# EasyEDA Pro project ZIAD_DBW_PROJECT_EDIT_9_MAY_2025.epro, board DBW_v4.1_2
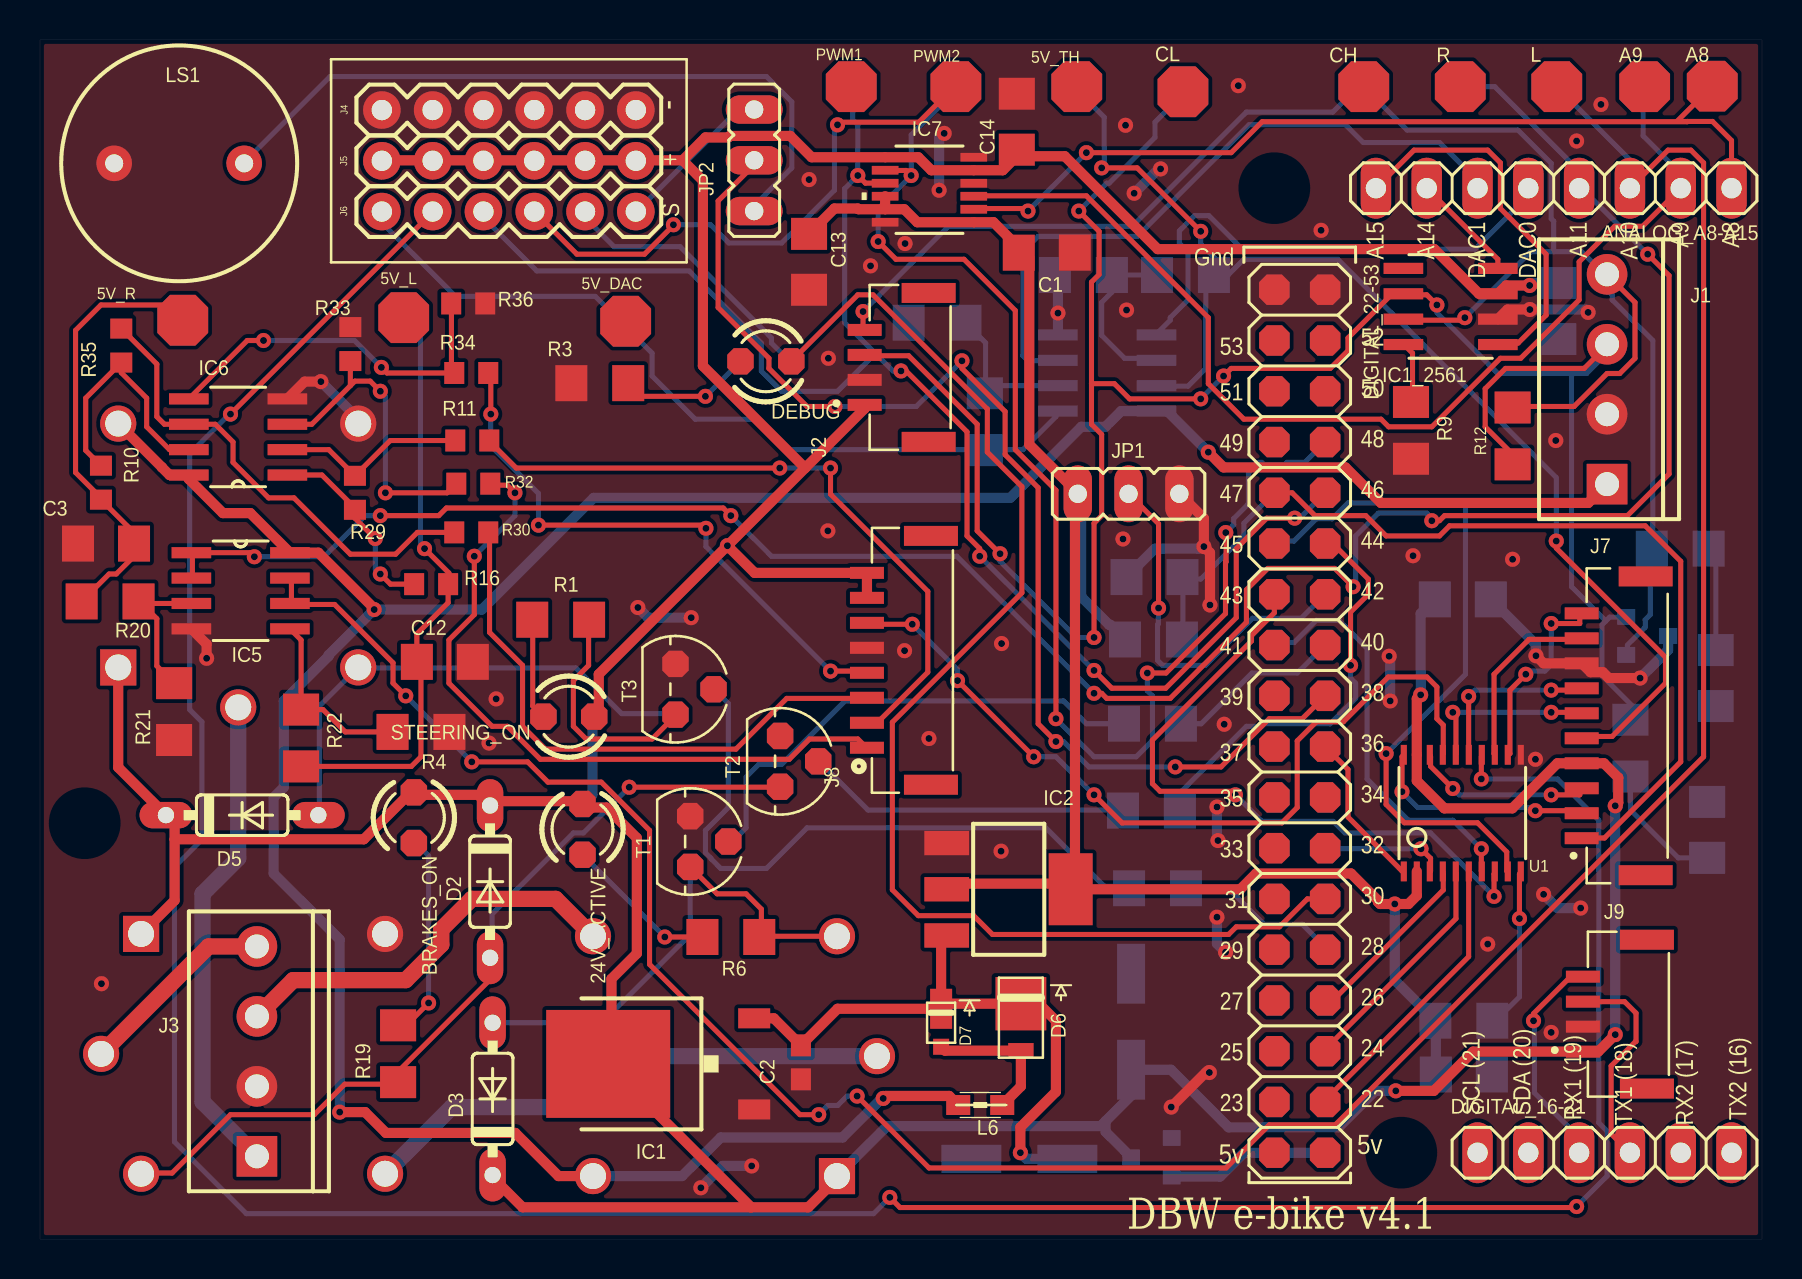
[diagram p7: board, top side]
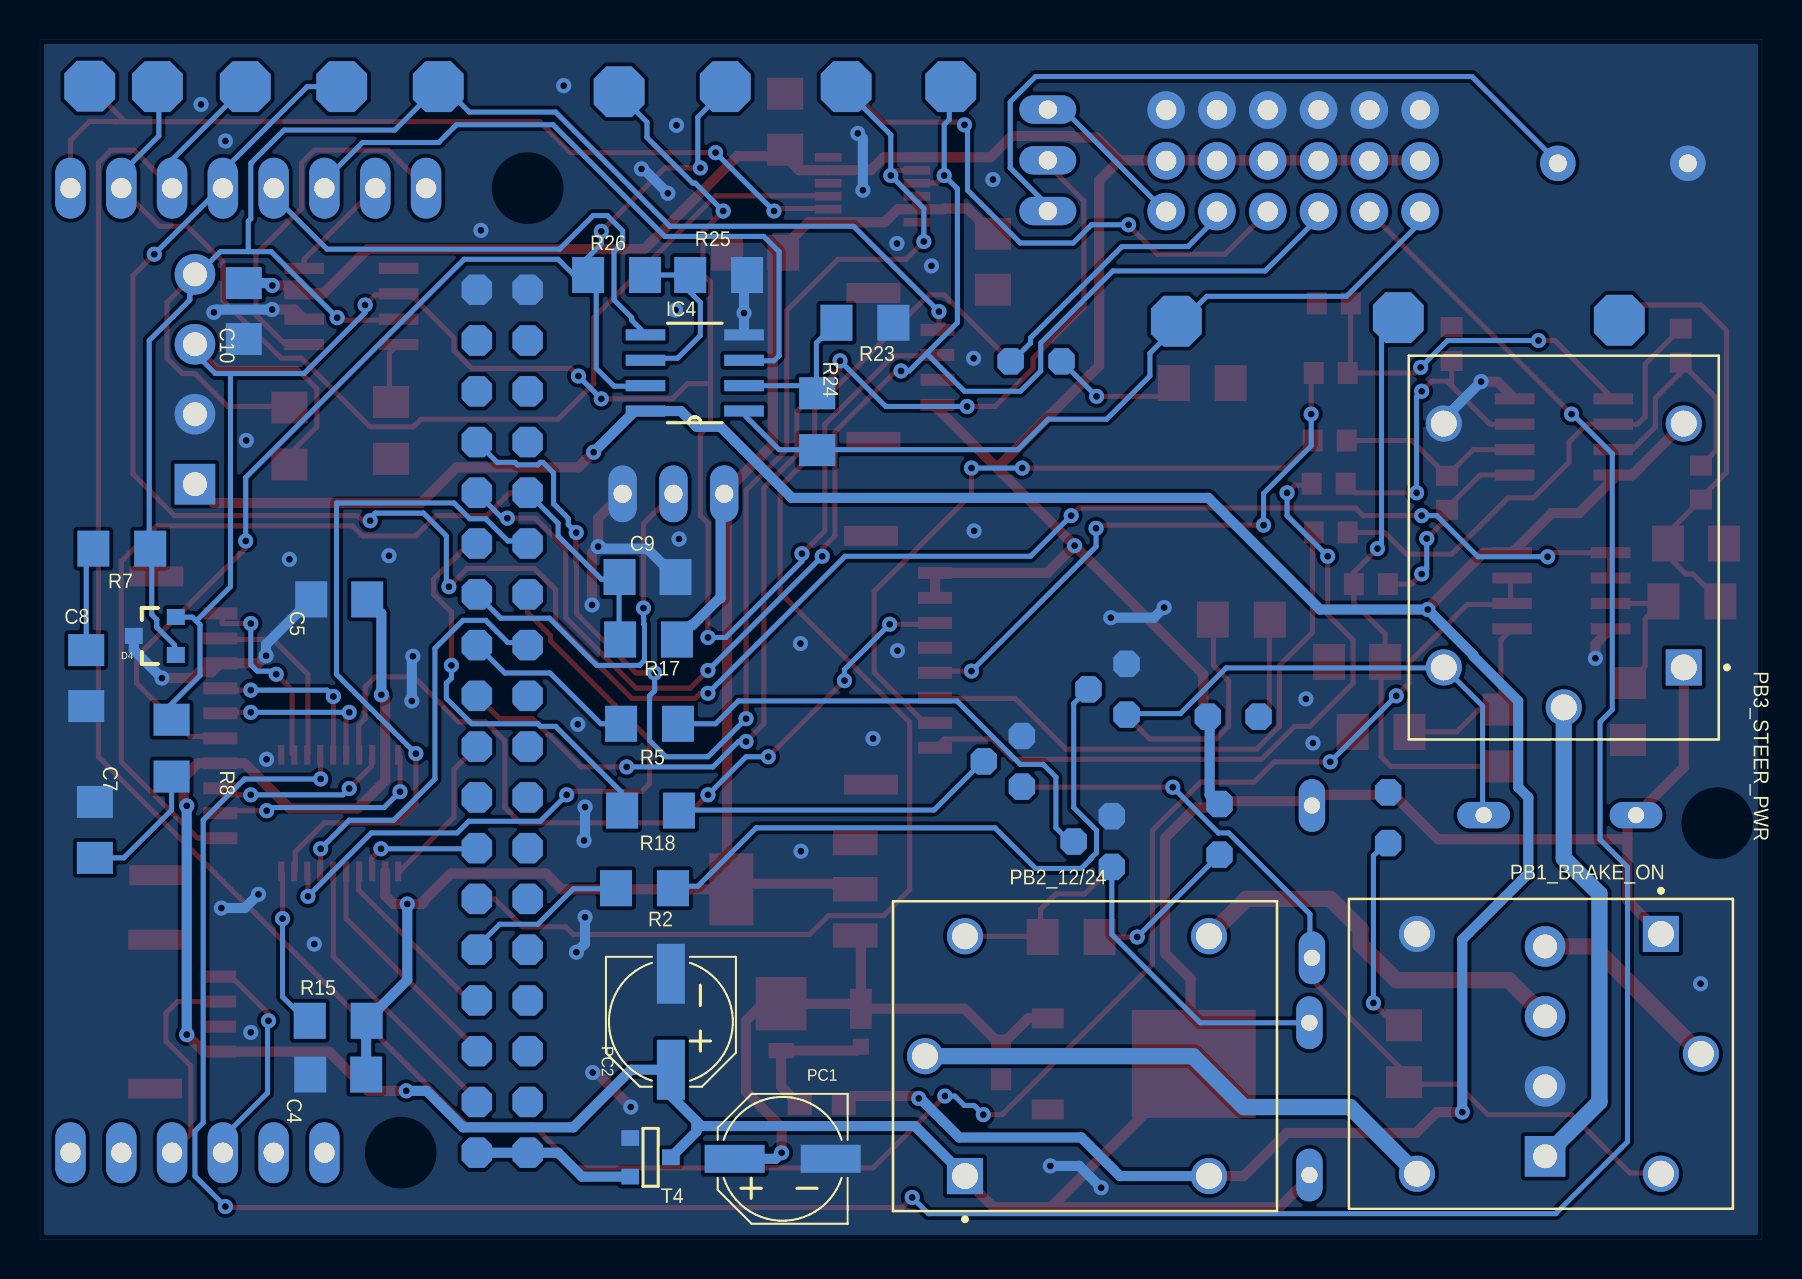
[diagram p8: board, bottom side, seen from below]

Outline 86.11 x 60 mm; copper layers: Top Layer, Bottom Layer. Coordinates in mm from the lower left corner of the outline.
Outline path: 0,60 0,0 86.11,0 86.11,60 0,60
Stack: Top Layer 0.035mm / Dielectric1 1.51mm FR4 er 4.5 / Bottom Layer 0.035mm

## Design rules (mm)
spacing safeClearance (default): track to track 0.254, other pairs 0.254 to 1.016
spacing Power: track to track 0.254, other pairs 0.254 to 1.016
spacing High Current: track to track 0.762, other pairs 0.762 to 1.016
spacing SPI_Signals: track to track 0.254, other pairs 0.254 to 1.016
spacing Oscillator: track to track 0.508, other pairs 0.508 to 1.016
track width trackWidth (default): min 0.254, default 0.254, max 2.54
track width Power: min 0.508, default 0.508, max 2.54
track width High Current: min 0.508, default 0.508, max 2.54
track width SPI_Signals: min 0.254, default 0.254, max 2.54
track width Oscillator: min 0.254, default 0.254, max 2.54
differential pair differentialPair (default): width min 0.127, default 0.254, max 2.54; gap min 0.152, default 0.152
via viaSize: diameter min 0.35, default 0.35, max 2.6; hole min 0.35, default 0.35, max 2
via default: diameter min 0.305, default 0.305, max 2.6; hole min 0.305, default 0.305, max 2
via Power: diameter min 0.305, default 0.305, max 2.6; hole min 0.305, default 0.305, max 2
via High Current: diameter min 0.305, default 0.305, max 2.6; hole min 0.305, default 0.305, max 2
via SPI_Signals (default): diameter min 0, default 0, max 2.6; hole min 0, default 0, max 2
via Oscillator: diameter min 0, default 0, max 2.6; hole min 0, default 0, max 2
net GND uses CopperRegion1, Power
net ARD+5V uses Power
net 12V_PROTECTION uses Power
net +3V3 uses Power
net +12V uses Power
net +5V uses Power
net +24V uses High Current
net 12V_OUT uses High Current
net SOLENOID_POWER uses High Current
pour ie1 uses CopperRegion
pour ie2 uses CopperRegion1

## Placement (name value [footprint] x y rotation side)
5V_DAC  PTR1PAD1-17  [P1-17]  29.29 45.92 0 top
5V_L  PTR1PAD1-17  [P1-17]  18.19 46.1 0 top
5V_R  PTR1PAD1-17  [P1-17]  7.14 45.97 0 top
5V_TH  PTR1PAD1-17  [P1-17]  51.84 57.66 0 top
24V_ACTIVE  LED3  [LED3MM]  27.13 20.5 270 top
A8  PTR1PAD1-17  [P1-17]  83.62 57.68 0 top
A9  PTR1PAD1-17  [P1-17]  80.24 57.66 0 top
ANALOG_A8-A15  ANALOG_A8-A15  [1X08]  75.69 52.58 180 top
BRAKES_ON  LED2  [LED3MM]  18.69 21.08 270 top
C1  0.1uF  [C1206]  50.34 49.35 0 top
C2  100n  [C0603]  38.05 8.84 90 top
C3  1uF  [C1206]  3.3 34.8 180 top
C4  0.1uF  [C1206]  71.2 8.23 0 bottom
C5  0.1uF  [C1206]  71.15 32 0 bottom
C7  560pF  [C1206]  83.36 20.47 90 bottom
C8  560pF  [C1206]  83.79 28.07 270 bottom
C9  1uF  [C1206]  55.73 33.12 180 bottom
C10  0.1uF  [C1206]  75.92 46.43 270 bottom
C12  1uF  [C1206]  20.24 28.88 0 top
C13  0.1uF  [C1206]  38.46 48.89 270 top
C14  0.1uF  [C1206]  48.84 55.91 90 top
CH  PTR1PAD1-17  [P1-17]  66.19 57.66 180 top
CL  PTR1PAD1-17  [P1-17]  57.15 57.4 0 top
D2  1N4148DO35-7  [DO35-7]  22.5 17.88 270 top
D3  1N4148DO35-7  [DO35-7]  22.63 7.01 90 top
D4  PESD1CAN  [SPARKFUN-DISCRETESEMI_SOT23-3]  80.31 30.17 90 bottom
D5  1N4148DO35-7  [DO35-7]  10.11 21.21 0 top
D6  SS1P3L  [DO220AAL]  49.05 11.07 270 top
D7  MSS1P3L-M3/89A  [MICROSMP]  45.06 10.82 270 top
DEBUG  DS1  [LED3MM]  36.3 43.92 180 top
DIGITAL_16-21  DIGITAL_16-21  [1X06]  78.23 4.32 0 top
DIGITAL_22-53  Digital 22-53  [PINHEAD_2X18]  62.99 25.91 270 top
IC1  MC33269D-5.0  [DPACK]  30.91 8.76 90 top
IC1_2561  MCP2561-E/SN  [SOIC8-N_MC_MCH]  70.54 46.66 180 top
IC2  MC33269ST-3.3T3  [SOT223]  48.44 17.5 270 top
IC4  LM358D  [D8]  53.37 43.33 0 bottom
IC5  LM358D  [D8]  10.03 32.44 0 top
IC6  LM358D  [D8]  9.91 40.13 180 top
IC7  LTC2644CMS-L10PBF  [MSOP-12_MS_LIT]  44.48 52.5 180 top
J1  CAN_1  [SCREWTERMINAL-3.5MM-4]  78.36 37.77 90 top
J2  CAN_2  [JST_SM04B-GHS-TB(LF)(SN)-]  43.51 43.61 90 top
J3  Brake_Steer_Connector  [SCREWTERMINAL-3.5MM-4]  10.85 4.14 90 top
J4  Ground  [1X06#2]  17.09 56.49 0 top
J5  Power  [1X06#2]  17.09 53.95 0 top
J6  Signal  [1X06#2]  17.09 51.41 0 top
J7  MOTOR  [JST_SM10B-GHS-TB(LF)(SN)]  80.29 25.68 90 top
J8  STEERING  [JST_SM08B-GHS-TB(LF)(SN)]  41.35 28.96 90 top
J9  ROS_CONN  [JST_SM04B-GHS-TB(LF)(SN)-]  79.43 11.25 90 top
JP1  3 pin  [JP2]  54.43 37.29 0 top
JP2  3 pin  [JP2]  35.71 53.97 90 top
L  PTR1PAD1-17  [P1-17]  75.84 57.66 0 top
L6  MH2029-300Y  [0805]  47.02 6.71 180 top
LS1  BUZZER-PTH  [BUZZER-12MM]  6.96 53.82 0 top
PB1_BRAKE_ON  ORWH-SH-105D1F,000  [TE_ORWH-SH-105D1F,000]  5.05 15.27 0 bottom
PB2_12/24  ORWH-SH-105D1F,000  [TE_ORWH-SH-105D1F,000]  39.85 3.15 180 bottom
PB3_STEER_PWR  ORWH-SH-105D1F,000  [TE_ORWH-SH-105D1F,000]  3.91 28.6 90 bottom
PC1  47u  [PANASONIC_D]  48.97 4.01 0 bottom
PC2  47u  [PANASONIC_D]  54.56 10.87 270 bottom
PWM1  PTR1PAD1-17  [P1-17]  40.56 57.66 0 top
PWM2  PTR1PAD1-17  [P1-17]  45.8 57.66 0 top
R  PTR1PAD1-17  [P1-17]  71.02 57.66 0 top
R1  1K  [R1206]  26.03 30.99 180 top
R2  1K  [R1206]  55.88 17.55 180 bottom
R3  1K  [R1206]  27.99 42.82 0 top
R4  10K  [R1206]  19.05 25.37 180 top
R5  1K  [R1206]  55.63 25.78 180 bottom
R6  1K  [R1206]  34.54 15.11 180 top
R7  100  [R1206]  82.02 34.54 180 bottom
R8  100  [R1206]  79.53 24.56 90 bottom
R9  4.7k  [R1206]  68.55 40.46 90 top
R10  4.7K  [R0603]  3.05 37.85 90 top
R11  22k  [R0603]  21.62 39.95 180 top
R12  120  [R1206]  73.63 40.18 90 top
R15  10K  [R1206]  71.2 10.92 180 bottom
R16  4.7K  [R0603]  19.56 32.77 180 top
R17  4.7K  [R1206]  55.68 30 0 bottom
R18  1K  [R1206]  55.57 21.44 180 bottom
R19  1K  [R1206]  17.91 9.27 90 top
R20  5.151K  [R1206]  3.5 31.9 180 top
R21  10K  [R1206]  6.71 26.39 270 top
R22  5.151K  [R1206]  13.06 25.07 270 top
R23  10K  [R1206]  44.86 45.85 0 bottom
R24  5.151K  [R1206]  47.24 40.89 270 bottom
R25  10K  [R1206]  52.17 48.23 0 bottom
R26  5.151K  [R1206]  57.28 48.23 0 bottom
R29  22k  [R0603]  15.75 37.34 90 top
R30  22k  [R0603]  21.56 35.36 0 top
R32  22k  [R0603]  21.67 37.8 180 top
R33  22k  [R0603]  15.52 44.78 270 top
R34  22k  [R0603]  21.56 43.33 180 top
R35  22k  [R0603]  4.06 44.7 270 top
R36  22k  [R0603]  21.41 46.81 0 top
STEERING_ON  LED1  [LED3MM]  26.44 26.14 180 top
T1  2N3904  [TO92]  32.51 19.89 270 top
T2  2N3904  [TO92]  37.01 23.9 270 top
T3  2N3904  [TO92]  31.78 27.51 270 top
T4  PMV48XP  [SOT-23]  55.57 4.06 90 bottom
U1  TXB0108PWR  [TSSOP20]  71.12 21.31 0 top

## Footprints (pads in the part's own frame, mm; a bottom-side part is the same pattern mirrored in y, then rotated)
1X06
  oval 1.524x3.048 hole 1.016: 1(-6.35,0) 2(-3.81,0) 3(-1.27,0) 4(1.27,0) 5(3.81,0) 6(6.35,0)
1X06#2
  round 1.879 hole 1.016: 1(0,0) 2(2.54,0) 3(5.08,0) 4(7.62,0) 5(10.16,0) 6(12.7,0)
1X08
  oval 1.524x3.048 hole 1.016: 1(-8.89,0) 2(-6.35,0) 3(-3.81,0) 4(-1.27,0) 5(1.27,0) 6(3.81,0) 7(6.35,0) 8(8.89,0)
0805
  rect 1.2x1 smd: 1(-1.1,0) 2(1.1,0)
BUZZER-12MM
  round 1.778 hole 0.9: +(3.25,0) -(-3.25,0)
C0603
  rect 1.1x1 smd: 1(-0.85,0) 2(0.85,0)
C1206
  rect 1.6x1.8 smd: 1(-1.4,0) 2(1.4,0)
D8
  rect 1.981x0.559 smd: 1(-2.464,1.905) 2(-2.464,0.635) 3(-2.464,-0.635) 4(-2.464,-1.905) 5(2.464,-1.905) 6(2.464,-0.635) 7(2.464,0.635) 8(2.464,1.905)
DO35-7
  oval 2.642x1.321 hole 0.813: A(3.81,0) C(-3.81,0)
DO220AAL
  rect 2.667x2.54 smd: P$1(-0.7,0)
  rect 0.762x1.27 smd: P$2(1.65,0)
DPACK
  rect 1x1.6 smd: 1(-2.28,-4.8) 3(2.28,-4.8)
  rect 5.4x6.2 smd: 2(0,2.5)
JP2
  oval 1.423x2.845 hole 0.914: 1(-2.54,0) 2(0,0) 3(2.54,0)
JST_SM04B-GHS-TB(LF)(SN)-
  rect 0.6x1.7 smd: 1(-1.875,2.275) 2(-0.625,2.275) 3(0.625,2.275) 4(1.875,2.275)
  rect 1x2.7 smd: SH1(-3.725,-0.925) SH2(3.725,-0.925)
JST_SM08B-GHS-TB(LF)(SN)
  rect 0.6x1.7 smd: 1(-4.375,0) 2(-3.125,0) 3(-1.875,0) 4(-0.625,0) 5(0.625,0) 6(1.875,0) 7(3.125,0) 8(4.375,0)
  rect 1x2.7 smd: SH1(-6.225,-3.2) SH2(6.225,-3.2)
JST_SM10B-GHS-TB(LF)(SN)
  rect 0.6x1.7 smd: 1(-5.625,3.2) 2(-4.375,3.2) 3(-3.125,3.2) 4(-1.875,3.2) 5(-0.625,3.2) 6(0.625,3.2) 7(1.875,3.2) 8(3.125,3.2) 9(4.375,3.2) 10(5.625,3.2)
  rect 1x2.7 smd: S1(-7.475,0) S2(7.475,0)
LED3MM
  custom 1.321x1.321 hole 0.813: A(-1.27,0) K(1.27,0)
MICROSMP
  rect 0.8x0.8 smd: A(1.2,0)
  rect 2x1.1 smd: K(-0.7,0)
MSOP-12_MS_LIT
  rect 1.333x0.432 smd: 1(-2.216,1.625) 2(-2.216,0.976) 3(-2.216,0.325) 4(-2.216,-0.325) 5(-2.216,-0.976) 6(-2.216,-1.625) 7(2.216,-1.625) 8(2.216,-0.976) 9(2.216,-0.325) 10(2.216,0.325) 11(2.216,0.976) 12(2.216,1.625)
P1-17
  custom 2.54x2.54 hole 1.702: TP(0,0)
PANASONIC_D
  rect 3x1.4 smd: +(2.4,0) -(-2.4,0)
PINHEAD_2X18
  custom 1.524x1.524 hole 1.016: 1(-21.59,-1.27) 2(-21.59,1.27) 3(-19.05,-1.27) 4(-19.05,1.27) 5(-16.51,-1.27) 6(-16.51,1.27) 7(-13.97,-1.27) 8(-13.97,1.27) 9(-11.43,-1.27) 10(-11.43,1.27) 11(-8.89,-1.27) 12(-8.89,1.27) 13(-6.35,-1.27) 14(-6.35,1.27) 15(-3.81,-1.27) 16(-3.81,1.27) 17(-1.27,-1.27) 18(-1.27,1.27) 19(1.27,-1.27) 20(1.27,1.27) 21(3.81,-1.27) 22(3.81,1.27) 23(6.35,-1.27) 24(6.35,1.27) 25(8.89,-1.27) 26(8.89,1.27) 27(11.43,-1.27) 28(11.43,1.27) 29(13.97,-1.27) 30(13.97,1.27) 31(16.51,-1.27) 32(16.51,1.27) 33(19.05,-1.27) 34(19.05,1.27) 35(21.59,-1.27) 36(21.59,1.27)
R0603
  rect 1x1.1 smd: 1(-0.85,0) 2(0.85,0)
R1206
  rect 1.6x1.803 smd: 1(-1.422,0) 2(1.422,0)
SCREWTERMINAL-3.5MM-4
  rect 2.032x2.032 hole 1.2: 1(0,0)
  round 2.032 hole 1.2: 2(3.5,0) 3(7,0) 4(10.5,0)
SOIC8-N_MC_MCH
  rect 1.981x0.559 smd: 1(-2.362,1.905) 2(-2.362,0.635) 3(-2.362,-0.635) 4(-2.362,-1.905) 5(2.362,-1.905) 6(2.362,-0.635) 7(2.362,0.635) 8(2.362,1.905)
SOT223
  rect 1.219x2.235 smd: 1(-2.312,-3.099) 2(0,-3.099) 3(2.312,-3.099)
  rect 3.6x2.2 smd: 4(0,3.099)
SOT-23
  rect 0.787x0.889 smd: 1(0.025,-1.016) 2(-0.94,1.016) 3(0.991,1.016)
SPARKFUN-DISCRETESEMI_SOT23-3
  rect 0.8x0.9 smd: 1(-0.95,-1) 2(0.95,-1) 3(0,1.1)
TE_ORWH-SH-105D1F,000
  rect 1.808x1.808 hole 1.3: 1(0,0)
  round 1.808 hole 1.3: 2(0,12) 3(-2,6) 4(12.2,0) 5(12.2,12)
TO92
  custom 1.321x1.321 hole 0.813: 1(1.27,0) 2(0,1.905) 3(-1.27,0)
TSSOP20
  rect 0.305x0.991 smd: 1(-2.925,-2.918) 2(-2.275,-2.918) 3(-1.625,-2.918) 4(-0.975,-2.918) 5(-0.325,-2.918) 6(0.325,-2.918) 7(0.975,-2.918) 8(1.625,-2.918) 9(2.275,-2.918) 10(2.925,-2.918) 11(2.925,2.918) 12(2.275,2.918) 13(1.625,2.918) 14(0.975,2.918) 15(0.325,2.918) 16(-0.325,2.918) 17(-0.975,2.918) 18(-1.625,2.918) 19(-2.275,2.918) 20(-2.925,2.918)

## Nets
5V_BRAKE_PULSE: J6.2 U1.14
5V_DAC1: 5V_DAC.TP IC4.1 J6.1 R24.2
5V_EBIKE_POWER_IN: J7.10 U1.12
5V_FWDSW: J7.2 U1.20
5V_L_SENSE: 5V_L.TP C12.1 R16.1 R22.2
5V_R_SENSE: 5V_R.TP C3.1 R10.1 R20.2
5V_REGEN: J7.7 U1.15
5V_REVERSE: J7.6 U1.16
5V_SPEEDOMETER: J7.9 U1.13
5V_STEER_PULSE: J8.6 U1.17
5V_THROTTLE: 5V_TH.TP IC4.7 J7.5 R26.2
5V_WATCHDOG: J7.3 U1.18
12V_OUT: J3.1 PB3_STEER_PWR.3
12V_PROTECTION: C2.2 D6.P$1 D7.K IC1.3 IC2.3 PC1.+
+3V3: C1.1 C4.1 C13.1 IC2.2 IC2.4 IC7.1 IC7.10 IC7.11 JP1.1 R15.2 R17.1 U1.2
+5V: 24V_ACTIVE.A BRAKES_ON.A C5.1 C10.1 C14.1 D2.C D3.C D5.C IC1.2 IC1_2561.3 IC7.5 IC7.7 J2.1 J5.1 J5.2 J5.3 J5.4 J5.5 J5.6 J7.4 J8.7 J8.8 J9.1 PB1_BRAKE_ON.1 PB2_12/24.1 PB3_STEER_PWR.1 PC2.+ STEERING_ON.A T4.1 U1.19
+12V: IC4.8 IC5.8 IC6.8 J1.1 L6.2 PB2_12/24.4 PB3_STEER_PWR.4
+24V: J3.3 PB2_12/24.5
GND: C1.2 C2.1 C3.2 C4.2 C5.2 C7.2 C8.2 C9.2 C10.2 C12.2 C13.2 C14.2 D4.3 DIGITAL_22-53.1 DIGITAL_22-53.2 IC1.1 IC1_2561.2 IC2.1 IC4.4 IC5.4 IC6.4 IC7.4 IC7.6 IC7.12 J1.2 J2.2 J3.2 J4.1 J4.2 J4.3 J4.4 J4.5 J4.6 J7.8 J8.5 J9.2 JP1.3 LS1.- PB1_BRAKE_ON.4 PB3_STEER_PWR.5 PC1.- PC2.- R3.1 R4.1 R9.1 R21.2 R23.1 R25.1 R33.1 R36.2 T1.3 T2.3 T3.3 T4.3 U1.11
ARD+5V: DIGITAL_22-53.35 DIGITAL_22-53.36 T4.2
BRAKE_ON: DIGITAL_22-53.12 R18.1
BRAKE_PULSE: DIGITAL_22-53.15 U1.7
BRAKE_VOLT: DIGITAL_22-53.16 R5.1
BUZZER: DIGITAL_22-53.18 JP2.2
CAN_ENABLE: DIGITAL_22-53.14 JP1.2
CANH: CH.TP D4.1 IC1_2561.7 J1.4 J2.4 R7.2 R12.2
CANL: CL.TP D4.2 IC1_2561.6 J1.3 J2.3 R8.2 R12.1
DAC1: ANALOG_A8-A15.6 IC4.3
DBW_LED: DEBUG.A DIGITAL_22-53.26 J6.5
EBIKE_POWER_IN: DIGITAL_22-53.11 U1.9
EXTERNAL_BUZZER: J6.6 JP2.3
FWDSW: DIGITAL_22-53.20 U1.1
INTERNAL_BUZZER: JP2.1 LS1.+
IRPT_WHEEL: C9.1 DIGITAL_22-53.9 J7.1 R17.2
L_ANGLE: J8.1 R32.1
L_RTN: J8.2 R11.1
L_SENSE: ANALOG_A8-A15.3 IC5.6 IC5.7 L.TP
LL_CANRX: ANALOG_A8-A15.7 IC1_2561.4
LL_CANTX: ANALOG_A8-A15.8 IC1_2561.1
N$2: R5.2 T1.2
N$3: C8.1 R7.1
N$4: 24V_ACTIVE.K R6.2
N$5: R2.2 T3.2
N$6: D6.P$2 D7.A L6.1
N$7: R18.2 T2.2
N$8: D5.A PB3_STEER_PWR.2 R1.1 T3.1
N$9: C7.1 R8.1
N$10: R1.2 STEERING_ON.K
N$11: D3.A PB2_12/24.2 R6.1 T1.1
N$12: D2.A PB1_BRAKE_ON.2 R19.1 T2.1
N$13: BRAKES_ON.K R19.2
N$14: IC6.2 R11.2 R29.2
N$15: IC6.3 R32.2 R33.2
N$16: DEBUG.K R3.2
N$17: IC5.5 R4.2 R22.1
N$18: IC4.2 R23.2 R24.1
N$19: IC4.6 R25.2 R26.1
N$20: R15.1 U1.10
N$22: IC6.1 R16.2 R29.1
N$23: IC6.5 R34.2 R36.1
N$24: IC5.3 R20.1 R21.1
N$25: IC6.7 R10.2 R35.2
N$26: IC6.6 R30.1 R35.1
N$44: IC1_2561.8 R9.2
PWM_1: DIGITAL_22-53.10 IC7.9 J6.3 PWM1.TP
PWM_2: DIGITAL_22-53.8 IC7.8 J6.4 PWM2.TP
PWM_MOTOR: A9.TP ANALOG_A8-A15.2 IC7.3
PWM_STEER: A8.TP ANALOG_A8-A15.1 IC7.2
R_ANGLE: J8.4 R34.1
R_RTN: J8.3 R30.2
R_SENSE: ANALOG_A8-A15.4 IC5.1 IC5.2 R.TP
REGEN: DIGITAL_22-53.34 U1.6
REVERSE: DIGITAL_22-53.32 U1.5
RX1_DBW: DIGITAL_16-21.3 J9.4
RX2_DBW: DIGITAL_16-21.5
SCL_DBW: DIGITAL_16-21.1
SDA_DBW: DIGITAL_16-21.2
SOLENOID_OUT: J3.4 PB1_BRAKE_ON.3
SOLENOID_POWER: PB1_BRAKE_ON.5 PB2_12/24.3
SPEEDOMETER: DIGITAL_22-53.13 U1.8
STEER_ON: DIGITAL_22-53.28 R2.1
STEER_PULSE: DIGITAL_22-53.30 U1.4
THROTTLE: ANALOG_A8-A15.5 IC4.5
TX1_DBW: DIGITAL_16-21.4 J9.3
TX2_DBW: DIGITAL_16-21.6
WATCHDOG: DIGITAL_22-53.24 U1.3

Pads without a net: DIGITAL_22-53 3 4 5 6 7 17 19 21 22 23 25 27 29 31 33; IC1_2561 5; J2 SH1 SH2; J7 S1 S2; J8 SH1 SH2; J9 SH1 SH2

## Via types
v1: diameter 0.756, hole 0.35, Top Layer to Bottom Layer, 151 vias

## Routing (per net, layer and track width the routed paths; a pad name or vN(x,y) marks a point on that pad's centre or on a via; arc(x,y) is an arc through that point)
5V_BRAKE_PULSE: length 152.7
  Top Layer w0.254: v1(42.49,2.08) 43,1.57 76.78,1.57 v1(76.84,1.63) ; v1(9.53,41.28) 19.53,51.28 J6.2 ; v1(72.07,23.02) 72.07,24.13 U1.14
  Bottom Layer w0.254: v1(9.53,41.28) 9.47,41.28 7.49,39.29 7.49,26.49 8.1,25.88 8.1,19.98 6.72,18.61 6.72,4.86 10.32,1.27 41.68,1.27 v1(42.49,2.08) ; v1(72.07,23.02) 75.88,23.02 77.95,20.95 77.95,5.81 78.36,5.4 78.36,3.15 v1(76.84,1.63)
5V_DAC1: length 40.8
  Bottom Layer w0.254: 47.24,39.5 37.21,39.5 35.69,41.02 32.77,41.02 30.61,43.18 30.61,44.32 29.34,45.59 29.34,45.85 5V_DAC.TP 29.21,45.97 28.96,45.97 27.76,47.17 20.78,47.17 17.14,50.8 17.14,51.31 J6.1 ; 47.24,39.5 49.15,39.5 50.8,41.15 50.8,41.4 IC4.1 ; 47.24,39.5 R24.2
5V_EBIKE_POWER_IN: length 10
  Top Layer w0.254: v1(75.56,30.8) 76.99,30.8 76.99,31.27 J7.10 ; v1(74.29,28.26) 73.5,27.46 73.5,24.29 U1.12
  Bottom Layer w0.254: v1(74.29,28.26) 74.45,28.42 75.25,28.42 75.56,28.73 v1(75.56,30.8)
5V_FWDSW: length 11.3
  Top Layer w0.254: U1.20 68.1,24.13 v1(68.1,22.38) ; J7.2 76.99,21.43 v1(74.77,21.43)
  Bottom Layer w0.254: v1(74.77,21.43) 74.61,21.59 68.9,21.59 v1(68.1,22.38)
5V_L_SENSE: length 29.9
  Top Layer w0.254: v1(19.23,34.54) 20.45,33.33 20.45,32.77 R16.1 20.41,31.84 18.84,30.27 C12.1 19.05,28.67 19.05,24.13 18.57,23.65 R22.2
  Bottom Layer w0.254: 5V_L.TP 19.02,45.26 19.02,34.75 v1(19.23,34.54)
5V_R_SENSE: length 22.3
  Top Layer w0.254: 5V_R.TP 6.38,46.74 3.05,46.74 1.78,45.47 1.78,38.35 3.05,37.08 R10.1 4.7,35.34 C3.1 4.7,34.17 3.81,33.27 3.45,33.27 R20.2
5V_REGEN: length 8.7
  Top Layer w0.254: J7.7 76.99,27.46 v1(75.56,27.46) ; v1(71.44,27.15) 71.44,24.29 U1.15
  Bottom Layer w0.254: v1(75.56,27.46) 71.75,27.46 v1(71.44,27.15)
5V_REVERSE: length 8.6
  Top Layer w0.254: v1(75.56,26.35) 76.99,26.35 J7.6 ; v1(70.64,26.35) 70.8,26.19 70.8,24.29 U1.16
  Bottom Layer w0.254: v1(75.56,26.35) v1(70.64,26.35)
5V_SPEEDOMETER: length 9.2
  Top Layer w0.254: U1.13 72.71,24.29 72.71,28.26 74.45,30 76.99,30 J7.9
5V_STEER_PULSE: length 41.7
  Top Layer w0.254: v1(43.62,30.76) 41.47,30.76 41.43,30.8 J8.6 ; U1.17 70.17,24.29 70.17,25.72 69.85,26.03 69.85,27.62 69.35,28.12 67.42,28.12 65.17,25.88 63.82,25.88 62.87,24.92 62.87,21.59 62.1,20.82 54.11,20.82 v1(52.71,22.22) ; v1(45.88,27.94) v1(49.69,24.13)
  Bottom Layer w0.254: v1(43.62,30.76) 45.88,28.5 v1(45.88,27.94) ; v1(49.69,24.13) 50.8,24.13 v1(52.71,22.22)
5V_THROTTLE: length 61.1
  Top Layer w0.254: v1(58.04,50.42) 54.86,53.59 v1(53.09,53.59) ; J7.5 77.22,25.15 78.61,25.15 81.28,27.81 81.28,29.11 75.82,34.57 v1(75.82,34.92)
  Bottom Layer w0.254: 55.83,42.7 55.88,42.67 57.4,42.67 58.29,43.56 58.29,47.75 58.67,48.13 58.7,48.23 ; v1(75.82,34.92) 75.82,38.1 64.9,49.02 60.2,49.02 59.44,48.26 58.8,48.26 58.7,48.23 ; v1(53.09,53.59) 53.21,53.72 53.21,56.13 51.94,57.4 51.94,57.66 5V_TH.TP ; 58.7,48.23 58.8,48.39 58.8,49.02 58.04,49.78 v1(58.04,50.42)
5V_WATCHDOG: length 9
  Top Layer w0.254: v1(70.64,22.54) 69.53,23.65 69.53,24.13 U1.18 ; J7.3 76.99,22.54 76.99,22.22 v1(75.56,22.22)
  Bottom Layer w0.254: v1(75.56,22.22) 70.96,22.22 v1(70.64,22.54)
12V_OUT: length 24.3
  Bottom Layer w0.813: J3.1 8.13,6.86 8.13,17.27 9.91,19.06 PB3_STEER_PWR.3
12V_PROTECTION: length 30.5
  Top Layer w0.508: D7.K 45.31,11.77 D6.P$1 49.95,11.77 50.8,10.92 50.8,7.37 49.02,5.59 v1(49.02,4.32) ; D7.K 45.06,14.91 IC2.3 ; D7.K 39.88,11.52 C2.2 36.7,11.04 IC1.3
  Bottom Layer w0.508: PC1.+ 49.33,4.01 v1(49.02,4.32)
+3V3: length 90.1
  Top Layer w0.508: IC2.4 60.02,17.5 60.81,18.29 65.56,18.29 66.9,16.94 66.9,16.87 67,16.76 v1(67.74,16.76) 68.43,16.76 68.84,17.18 U1.2 ; IC2.4 51.75,17.78 51.75,37.15 JP1.1 51.75,37.47 49.47,39.75 49.47,49.08 48.94,49.35 48.94,49.61 47.68,50.88 IC7.1 43.87,50.88 43.22,51.53 IC7.11 ; IC2.4 51.44,17.78 45.4,17.78 IC2.2 ; IC7.11 IC7.10 ; IC7.11 40.93,51.53 40.89,51.56 39.72,51.56 C13.1
  Bottom Layer w0.508: v1(67.74,16.76) 67.74,12.95 R15.2 69.8,10.9 C4.1 ; R17.1 53.52,30.73 53.46,30.73 52.12,32.07 52.07,32.07 52.07,37.15 JP1.1
+5V: length 279.1
  Top Layer w0.508: 6.73,20 6.73,16.94 PB1_BRAKE_ON.1 ; 6.73,20 16.19,20 18.41,22.22 BRAKES_ON.A 18.73,22.22 21.91,22.22 22.22,21.91 D2.C 22.54,21.91 26.99,21.91 24V_ACTIVE.A 27.31,21.59 28.32,21.59 29.84,20.07 29.84,14.29 28.57,13.02 28.57,8.89 IC1.2 28.57,8.57 35.56,1.59 ; 6.73,20 6.73,20.78 3.91,23.6 PB3_STEER_PWR.1 ; 38.26,38.58 33.15,43.69 33.15,52.96 32.13,53.97 ; 38.26,38.58 v1(34.37,34.69) ; 38.26,38.58 41.24,41.55 41.24,41.74 ; PB2_12/24.1 39.69,2.86 38.42,1.59 35.56,1.59 ; 32.13,53.97 29.84,53.97 J5.6 29.53,53.97 27.31,53.97 J5.5 26.99,53.97 24.76,53.97 J5.4 24.45,53.97 22.22,53.97 J5.3 21.91,53.97 19.69,53.97 J5.2 19.37,53.97 17.14,53.97 J5.1 ; 32.13,53.97 33.27,55.12 34.42,55.12 34.5,55.19 37.52,55.19 38.58,54.13 IC7.7 43.92,54.13 44.57,53.48 48.14,53.48 48.84,54.18 ; v1(34.37,34.69) 35.73,33.33 J8.8 J8.7 ; v1(34.37,34.69) 27.94,28.26 27.94,26.35 STEERING_ON.A ; v1(78.77,21.68) 78.92,21.83 78.92,23.09 78.2,23.8 J7.4 75.87,23.8 73.62,21.55 70.22,21.55 68.84,22.92 U1.19 68.84,27.04 v1(69.04,27.23) ; 48.84,54.18 C14.1 ; 48.84,54.18 51.24,54.18 55.89,49.53 69.72,49.53 71.96,47.3 IC1_2561.3 73.31,47.71 v1(74.49,47.71) ; v1(67.79,7.41) 69.69,7.41 71.66,9.38 77.92,9.38 v1(78.77,10.23) ; 35.56,1.59 24.13,1.59 22.66,3.06 D3.C
  Bottom Layer w0.508: C5.1 69.04,31.3 v1(69.04,27.23) ; v1(74.49,47.71) 74.61,47.83 C10.1 ; 53.28,5.9 53.28,5.37 T4.1 ; 53.28,5.9 53.03,5.65 42.35,5.65 PB2_12/24.1 ; 53.28,5.9 54.56,7.18 PC2.+ 56.55,8.47 59.44,5.59 64.94,5.59 66.77,7.41 v1(67.79,7.41) ; STEERING_ON.A 27.62,26.03 27.62,22.22 27.31,21.91 24V_ACTIVE.A ; v1(78.77,21.68) v1(78.77,10.23)
+12V: length 147.6
  Top Layer w0.508: J1.1 77.42,36.83 67.06,36.83 65.28,38.61 59.18,38.61 v1(58.42,39.37) ; v1(14.99,6.35) 16.26,6.35 17.3,5.31 23.77,5.31 25.93,3.15 PB2_12/24.4 ; v1(16.71,31.5) 16.71,31.55 13.92,34.34 12.5,34.34 10.52,36.32 9.14,36.32 7.44,38.02 IC6.8 6.48,38.23 6.1,38.61 6.1,38.62 PB3_STEER_PWR.4 ; L6.2 45.46,7.16 42.29,7.16 v1(42.16,7.03)
  Bottom Layer w0.508: v1(58.42,39.37) 56.36,41.43 54.06,41.43 53.27,40.64 52.07,40.64 48.51,37.08 27.69,37.08 22.1,31.5 v1(16.71,31.5) 14.43,29.21 14.43,29.16 12.19,26.92 12.19,22.61 11.68,22.1 11.68,18.29 14.99,14.99 v1(14.99,6.35) ; v1(42.16,7.03) 42.09,7.03 40.13,5.08 34.04,5.08 32.11,3.15 PB2_12/24.4
+24V: length 20.5
  Top Layer w0.813: PB2_12/24.5 25.78,17.02 21.59,17.02 20.07,15.49 20.07,14.73 18.29,12.95 12.66,12.95 J3.3
GND: length 58.6
  Top Layer w0.508: IC1_2561.2 73.38,46.51 v1(74.5,46.51) ; v1(8.33,29.06) 8.33,29.77 IC5.4 ; v1(56.57,6.6) 58.29,8.33 v1(58.47,8.33) ; v1(80.01,28.07) 78.44,28.07 78.15,28.36 77.53,28.36 J7.8 75.18,28.8 v1(74.8,29.18) ; v1(58.5,31.72) 58.5,34.34 v1(58.2,34.65) 58.2,36.06 JP1.3 ; IC6.4 13.23,42.9 v1(14.05,42.9)
  Bottom Layer w0.508: C5.2 74.8,29.75 v1(74.8,29.18) ; v1(58.85,21.62) 58.85,19.99 v1(58.9,19.94) ; PB3_STEER_PWR.5 15.91,41.03 v1(14.05,42.9) ; v1(29.9,31.6) 30.4,31.09 v1(32.56,31.09) ; v1(67.46,29.16) 67.51,29.11 v1(67.51,26.92) ; v1(45.21,55.32) 44.96,55.07 v1(44.96,52.48) ; v1(54.71,52.32) 55.93,53.54 v1(56.03,53.54) ; v1(74.5,46.51) 77.27,46.51 v1(77.41,46.36) ; v1(35.59,3.66) 34.14,3.66 v1(33.05,2.57) ; v1(80.01,28.07) 81.41,29.47 D4.3 ; v1(77.04,16.56) 75.87,16.56 v1(75.18,17.25) ; IC4.4 v1(50.9,46.33) 50.9,48.08 R25.1 ; v1(59.28,14.35) 58.85,14.78 v1(58.85,16.1) ; C9.2 55.75,34.54 57.92,34.54 58.02,34.65 v1(58.2,34.65)
  vias: v1(3.07,12.78) v1(22.45,24.82) v1(22.81,27.03) v1(38.46,53.01) v1(39.42,44.07) v1(39.4,35.43) v1(41.53,48.69) v1(43.23,29.44) v1(43.26,49.81) v1(44.45,25.04) v1(48.08,29.79) v1(48.06,19.41) v1(54.15,35.03) v1(54.28,55.73) v1(54.33,46.48) v1(59.21,25.76) v1(59.92,57.71) v1(64.06,50.47) v1(68.66,34.19) v1(72.39,14.76) v1(73.63,34.01) v1(74.78,24) v1(75.56,10.34) v1(75.79,39.95) v1(76.84,54.94) v1(78.05,56.77)
ARD+5V: length 8.2
  Bottom Layer w0.508: 56.59,3.12 59,3.12 60.2,4.32 DIGITAL_22-53.35 DIGITAL_22-53.36
BRAKE_ON: length 21
  Top Layer w0.254: DIGITAL_22-53.12 64.64,34.8 66.42,33.02 66.42,32.26 65.53,31.37 v1(65.53,28.7)
  Bottom Layer w0.254: v1(65.53,28.7) 65.53,28.07 65.79,27.81 65.79,27.05 64.52,25.78 61.21,25.78 61.09,25.65 60.32,25.65 57.02,22.35 57.02,21.46 R18.1
BRAKE_PULSE: length 20.6
  Top Layer w0.254: U1.7 72.07,18.42 v1(72.07,19.53)
  Bottom Layer w0.254: DIGITAL_22-53.15 61.75,29.84 62.71,29.84 63.82,30.96 64.95,30.96 66.36,29.55 66.36,23.02 68.42,20.95 70.64,20.95 v1(72.07,19.53)
BRAKE_VOLT: length 8.8
  Bottom Layer w0.254: DIGITAL_22-53.16 62.87,28.32 60.6,28.32 58.06,25.78 R5.1
BUZZER: length 60.1
  Top Layer w0.254: v1(56.77,23.62) 59.06,23.62 61.47,26.03 63.12,26.03 DIGITAL_22-53.18 ; v1(39.75,41.66) 38.35,41.66 36.45,43.56 36.45,44.07 33.91,46.61 33.91,51.94 35.69,53.72 35.69,53.97 JP2.2 ; v1(50.8,24.89) 49.91,25.78 49.91,37.59 48.26,39.24 48.26,41.4 46.1,43.56 v1(46.1,43.94)
  Bottom Layer w0.254: v1(39.75,41.66) 43.81,41.66 v1(46.1,43.94) ; v1(56.77,23.62) 52.45,23.62 51.18,24.89 v1(50.8,24.89)
CAN_ENABLE: length 18.9
  Top Layer w0.254: JP1.2 55.93,35.79 v1(55.93,31.57)
  Bottom Layer w0.254: v1(55.93,31.57) 55.93,31.07 55.92,31.06 55.92,30.77 55.88,30.73 55.88,28.96 56.13,28.7 58.27,28.7 60.63,31.06 63.07,31.06 DIGITAL_22-53.14
CANH: length 90.8
  Top Layer w0.254: v1(71.25,46.1) 71.12,45.97 68.2,45.97 IC1_2561.7 ; v1(41.16,46.41) 41.16,45.49 41.24,45.49 ; R12.2 73.66,41.66 76.71,41.66 78.36,43.31 78.99,43.31 79.76,44.07 79.76,46.86 78.36,48.26 J1.4
  Bottom Layer w0.254: v1(71.25,46.1) 74.55,49.4 75.69,49.4 ; v1(41.16,46.41) 45.42,50.67 54.61,50.67 60.32,56.39 64.64,56.39 65.91,57.66 CH.TP 68.36,55.49 73.9,55.49 75.56,53.82 75.56,51.05 75.69,50.93 75.69,49.4 ; 75.69,49.4 77.09,49.4 78.1,48.39 78.36,48.39 J1.4 78.36,47.5 78.61,47.24 78.61,46.99 80.65,44.96 80.65,34.54 R7.2 80.52,34.54 80.52,31.24 80.26,30.99 80.26,30.61 79.38,29.72 79.38,29.34 D4.1
CANL: length 113.9
  Top Layer w0.254: v1(52.71,30.1) 52.71,35.81 53.09,36.19 53.09,40.26 52.58,40.77 52.58,42.8 ; v1(51.94,51.44) 52.96,50.42 52.96,48.26 52.58,47.88 52.58,42.8 ; J1.3 78.36,44.7 77.22,43.56 73.28,43.56 72.26,42.55 72.26,40.64 73.53,39.37 73.53,38.86 73.63,38.76 ; 41.24,44.24 41.28,44.2 43.43,44.2 46.86,40.77 46.86,35.43 v1(48.01,34.29) ; 52.58,42.8 53.72,42.8 54.48,42.04 v1(58.04,42.04) ; v1(59.18,43.18) 59.56,43.56 64.52,43.56 65.41,44.45 65.41,45.08 67.56,47.24 68.07,47.24 IC1_2561.6 68.2,47.24 69.34,47.24 v1(69.85,46.74)
  Bottom Layer w0.254: v1(69.85,46.74) 69.85,46.36 72.9,43.31 76.58,43.31 ; v1(52.71,30.1) 51.82,30.1 48.01,33.91 v1(48.01,34.29) ; 76.58,43.31 76.58,32.64 78.3,30.92 ; 76.58,43.31 77.34,43.31 78.36,44.32 J1.3 ; CL.TP 57.15,57.28 55.75,55.88 55.75,55.12 53.47,52.83 53.34,52.83 v1(51.94,51.44) ; 78.3,30.92 78.1,30.73 78.1,28.19 79.63,26.67 79.63,26.03 R8.2 ; 78.3,30.92 78.49,31.11 79.25,31.11 D4.2 ; v1(58.04,42.04) v1(59.18,43.18)
DAC1: length 34
  Bottom Layer w0.254: ANALOG_A8-A15.6 71.88,52.96 69.98,54.86 66.17,54.86 65.28,55.75 60.45,55.75 54.86,50.17 49.91,50.17 49.15,49.4 49.15,44.2 49.4,43.94 50.8,43.94 IC4.3
DBW_LED: length 78
  Top Layer w0.254: DEBUG.A 40.89,47.24 41.66,47.24 47.37,41.53 47.37,39.37 49.1,37.64 49.1,32.33 42.62,25.86 42.62,17.47 43.92,16.18 46.69,16.18 47.62,15.24 59.44,15.24 59.82,15.62 61.98,15.62 63.37,17.02 DIGITAL_22-53.26
  Bottom Layer w0.254: DEBUG.A 37.47,43.94 36.58,44.83 36.58,45.08 32,49.66 28.7,49.66 27.31,51.05 27.31,51.31 J6.5
EBIKE_POWER_IN: length 35.2
  Top Layer w0.254: v1(67.31,24.29) 67.31,21.74 68.22,20.83 71.88,20.83 73.34,19.37 73.34,18.42 U1.9
  Bottom Layer w0.254: DIGITAL_22-53.11 61.75,34.92 62.71,34.92 63.82,36.04 64.61,36.04 65.41,36.83 71.28,36.83 71.28,28.26 v1(67.31,24.29)
EXTERNAL_BUZZER: length 8
  Bottom Layer w0.254: JP2.3 34.93,56.52 29.84,51.44 J6.6
FWDSW: length 7.9
  Top Layer w0.254: U1.1 68.1,18.42 65.41,21.11 65.41,23.5 DIGITAL_22-53.20
INTERNAL_BUZZER: length 36
  Bottom Layer w0.254: LS1.+ 10.21,53.87 14.5,58.17 36.32,58.17 37.59,56.9 37.59,53.59 35.81,51.82 35.81,51.44 35.71,51.44
IRPT_WHEEL: length 48.7
  Top Layer w0.254: J7.1 77.22,20.07 78.23,20.07 82.04,23.88 82.04,33.91 80.26,35.69 70.49,35.69 69.98,35.18 67.31,35.18 66.29,36.19 63.75,36.19 62.61,37.34 DIGITAL_22-53.9
  Bottom Layer w0.254: R17.2 57.15,30.1 57.15,33.02 C9.1 57.28,33.02 58.04,33.02 60.2,35.18 60.2,35.81 DIGITAL_22-53.9
L_ANGLE: length 35.4
  Top Layer w0.254: J8.1 41.28,24.64 40.89,25.02 38.48,25.02 37.47,24 25.02,24 23.37,25.65 22.61,25.65 20.45,27.81 20.45,29.97 21.72,31.24 v1(21.72,34.16) ; v1(23.75,37.34) 23.37,37.72 22.61,37.72 R32.1
  Bottom Layer w0.254: v1(23.75,37.34) 23.75,36.19 v1(21.72,34.16)
L_RTN: length 34
  Top Layer w0.254: R11.1 22.54,39.85 23.81,38.58 v1(36.99,38.58) ; v1(39.53,38.58) 39.53,37.27 44.39,32.4 44.39,28.36 41.91,25.88 41.43,25.88 J8.2
  Bottom Layer w0.254: v1(39.53,38.58) v1(36.99,38.58)
L_SENSE: length 138.6
  Top Layer w0.254: v1(18.29,27.18) 17.65,27.81 17.65,28.83 14.73,31.75 12.57,31.75 IC5.6 12.57,31.88 12.57,33.02 IC5.7 ; v1(21.59,23.88) 24.38,23.88 25.4,22.86 28.07,22.86 30.48,20.45 30.48,13.74 38,6.22 v1(38.94,6.22) ; ANALOG_A8-A15.3 81.41,54.48 82.55,54.48 83.19,53.85 83.19,24.13 64.77,5.72 61.47,5.72 59.31,3.56 44.46,3.56 v1(40.86,7.15)
  Bottom Layer w0.254: ANALOG_A8-A15.3 79.5,54 L.TP ; v1(21.59,23.88) v1(18.29,27.18) ; v1(38.94,6.22) 39.4,6.68 39.89,6.68 40.36,7.15 v1(40.86,7.15)
LL_CANRX: length 5.5
  Top Layer w0.254: ANALOG_A8-A15.7 72.9,49.02 IC1_2561.4
LL_CANTX: length 18.9
  Top Layer w0.254: ANALOG_A8-A15.8 68.71,54.48 72.39,54.48 73.03,53.85 73.03,51.56 75.31,49.28 75.31,46.23 73.91,44.83 72.9,44.83 IC1_2561.1
N$2: length 24.7
  Bottom Layer w0.254: T1.2 34.62,19.89 35.31,20.57 35.31,23.11 35.94,23.75 37.08,23.75 40.26,26.92 51.18,26.92 52.32,25.78 R5.2
N$3: length 5.2
  Bottom Layer w0.254: R7.1 83.79,34.19 C8.1
N$4: length 7.7
  Top Layer w0.254: v1(31.24,15.11) R6.2
  Bottom Layer w0.254: 24V_ACTIVE.K v1(31.24,15.11)
N$5: length 32.6
  Bottom Layer w0.254: R2.2 54.36,17.65 53.21,17.65 50.29,20.57 38.35,20.57 36.32,18.54 34.04,18.54 33.55,19.02 33.55,19.05 33.27,19.33 33.27,20.45 34.42,21.59 34.42,26.8 33.78,27.43 T3.2
N$6: length 7.2
  Top Layer w0.508: L6.1 49.05,7.64 D6.P$2 45.26,9.42 D7.A
N$7: length 16.2
  Bottom Layer w0.254: R18.2 54.1,21.46 41.4,21.46 38.99,23.88 T2.2
N$8: length 36.7
  Top Layer w0.254: R1.1 27.43,30.99 27.43,28.7 26.67,27.94 26.67,25.65 27.31,25.02 30.61,25.02 31.75,26.16 T3.1
  Bottom Layer w0.254: D5.A 13.97,21.21 13.97,26.67 15.88,28.58 PB3_STEER_PWR.2 16,28.58 26.8,28.58 29.08,26.29 31.75,26.29 T3.1
N$9: length 6.5
  Bottom Layer w0.254: R8.1 79.53,21.46 81.92,19.07 C7.1
N$10: length 5.1
  Top Layer w0.254: R1.2 24.64,30.99 24.64,26.67 STEERING_ON.K
N$11: length 24.8
  Top Layer w0.254: PB2_12/24.2 36.14,15.15 36.07,15.22 ; 36.07,15.22 R6.1 ; 36.07,15.22 36.07,16.51 35.31,17.27 33.86,17.27 T1.1
  Bottom Layer w0.254: D3.A 28.09,10.82 32.51,15.24 T1.1
N$12: length 42.2
  Top Layer w0.254: PB1_BRAKE_ON.2 5.08,3.3 6.6,3.3 9.53,6.22 13.72,6.22 15.24,7.75 17.91,7.75 R19.1 17.91,8.38 22.48,12.95 22.48,13.97 D2.A ; T2.1 36.96,22.61 v1(29.46,22.61)
  Bottom Layer w0.254: D2.A 22.61,14.1 22.61,16.26 26.67,20.32 27.18,20.32 v1(29.46,22.61)
N$13: length 10.4
  Top Layer w0.254: 17.91,10.69 17.91,10.79 18.41,10.79 v1(19.43,11.81)
  Bottom Layer w0.254: BRAKES_ON.K 18.8,19.81 19.43,19.18 v1(19.43,11.81)
N$14: length 9.7
  Top Layer w0.254: IC6.2 14.44,39.5 R29.2 17.51,39.95 R11.2
N$15: length 15.9
  Top Layer w0.254: v1(17.27,37.34) 20.36,37.34 R32.2 ; IC6.3 13.59,40.77 15.52,42.7 ; v1(17.02,42.42) 16.51,42.93 15.75,42.93 15.52,42.7 ; 15.52,42.7 R33.2
  Bottom Layer w0.254: v1(17.02,42.42) 17.27,42.16 v1(17.27,37.34)
N$16: length 6.6
  Top Layer w0.254: v1(33.27,42.16) 30.07,42.16 R3.2
  Bottom Layer w0.254: DEBUG.K v1(33.27,42.16)
N$17: length 9.3
  Top Layer w0.254: IC5.5 13.06,29.97 R22.1 14.15,26.49 15.27,25.37 R4.2
N$18: length 7.7
  Bottom Layer w0.254: 47.28,42.35 47.63,42.7 IC4.2 ; 47.28,42.35 47.28,44.84 R23.2 ; 47.28,42.35 R24.1
N$19: length 8.8
  Bottom Layer w0.254: 55.83,43.97 55.75,44.07 54.23,44.07 53.09,45.21 53.09,46.86 53.59,47.37 53.59,48.13 R25.2 R26.1
N$20: length 8.1
  Top Layer w0.254: v1(73.98,16.03) 73.98,18.26 74.04,18.39
  Bottom Layer w0.254: R15.1 72.78,10.92 73.98,12.12 v1(73.98,16.03)
N$22: length 9.8
  Top Layer w0.254: R16.2 17.53,32.77 v1(17.02,33.27) ; v1(16.76,35.05) 15.75,36.06 R29.1 15.75,36.58 14.1,38.23 IC6.1
  Bottom Layer w0.254: v1(16.76,35.05) 16.76,33.53 v1(17.02,33.27)
N$23: length 18.7
  Top Layer w0.254: v1(17.07,43.61) 17.35,43.33 R34.2 20.57,43.43 20.57,46.74 R36.1 ; v1(11.18,44.96) 10.36,44.96 IC6.5
  Bottom Layer w0.254: v1(11.18,44.96) 15.72,44.96 v1(17.07,43.61)
N$24: length 7.3
  Top Layer w0.254: 5.23,31.65 5.39,31.8 IC5.3 ; 5.23,31.65 5.84,31.04 5.84,28.68 R21.1 ; 5.23,31.65 5.08,31.8 5.03,31.8 4.93,31.9
N$25: length 12.5
  Top Layer w0.254: R10.2 2.29,39.46 2.29,42.08 R35.2 4.06,43.35 5.33,42.08 5.33,40.64 6.48,39.5 IC6.7
N$26: length 23.9
  Top Layer w0.254: R30.1 18.87,35.36 17.78,34.26 15.52,34.26 12.7,37.08 11.43,37.08 9.65,38.86 9.65,39.88 8.76,40.77 IC6.6 6.22,40.77 5.84,41.15 5.84,43.78 R35.1
N$44: length 3.1
  Top Layer w0.254: R9.2 68.63,41.96 68.63,44.32 68.2,44.75 IC1_2561.8
PWM_1: length 79.8
  Top Layer w0.254: v1(43.05,43.43) 43.31,43.43 46.35,40.39 46.35,35.18 46.99,34.54 v1(46.99,34.16) ; v1(52.71,28.45) 53.59,27.56 56.29,27.56 59.82,31.09 59.82,34.54 61.34,36.07 v1(62.74,36.07) ; v1(40.89,53.21) 41.28,52.83 42.16,52.83 IC7.9
  Bottom Layer w0.254: J6.3 22.22,51.31 22.22,51.05 24.84,48.44 32.46,48.44 36.07,44.83 36.07,43.43 37.08,42.42 39.88,42.42 41.77,44.31 ; 41.77,44.31 42.65,43.43 v1(43.05,43.43) ; 41.77,44.31 40.23,45.85 40.23,52.55 v1(40.89,53.21) 40.89,55.75 40.64,56.01 40.64,57.66 PWM1.TP ; v1(46.99,34.16) v1(52.71,28.45) ; v1(62.74,36.07) 62.99,36.07 DIGITAL_22-53.10
PWM_2: length 95.1
  Top Layer w0.254: 42.26,53.48 42.29,53.47 43.31,53.47 v1(43.56,53.21) ; v1(50.8,26.03) 50.8,37.47 48.77,39.5 48.77,46.46 46.2,49.02 42.8,49.02 v1(41.91,49.91) ; v1(59.29,35.35) 59.31,35.33 59.31,33.88 59.28,33.91 59.28,31.3 56.3,28.32 v1(55.37,28.32) ; PWM2.TP 45.72,57.66 43.94,55.88 40.01,55.88 v1(39.88,55.75) ; J6.4 26.85,49.28 30.23,49.28 31.67,50.72 v1(31.67,50.75)
  Bottom Layer w0.254: v1(55.37,28.32) 55.37,27.43 55.63,27.18 55.63,24.94 54.81,24.13 52.71,24.13 v1(50.8,26.03) ; v1(41.91,49.91) 41.91,51.56 v1(43.56,53.21) 43.56,55.25 45.72,57.4 45.72,57.66 PWM2.TP ; v1(59.29,35.35) 59.69,35.74 59.69,36.05 60.43,36.79 60.43,38.33 60.96,38.86 61.09,38.86 61.21,38.73 62.23,38.73 62.36,38.86 63.25,38.86 DIGITAL_22-53.8 ; v1(39.88,55.75) 39.73,55.6 39.73,52.48 37.08,49.83 34.44,49.83 33.53,50.75 v1(31.67,50.75)
PWM_MOTOR: length 54
  Top Layer w0.254: IC7.3 46.74,52.2 52.32,52.2 58.42,46.1 58.42,42.8 60.2,41.02 67.06,41.02 67.44,40.64 69.6,40.64 73.03,44.07 74.04,44.07 76.96,46.99 76.96,48.89 78.74,50.67 80.14,50.67 ANALOG_A8-A15.2
  Bottom Layer w0.254: A9.TP 80.16,57.58 80.16,55.19 82.04,53.31 ANALOG_A8-A15.2
PWM_STEER: length 45.6
  Top Layer w0.254: v1(49.4,51.44) 49.28,51.56 46.74,51.56 IC7.2 ; 82.38,55.92 82.37,55.91 61.11,55.91 59.56,54.36 v1(52.32,54.36) ; 82.38,55.92 83.63,55.92 84.58,54.97 ANALOG_A8-A15.1 ; 82.38,55.92 81.85,55.92 A8.TP
  Bottom Layer w0.254: v1(52.32,54.36) v1(49.4,51.44)
R_ANGLE: length 28.7
  Top Layer w0.254: v1(24.92,35.72) 33.14,35.72 v1(33.3,35.56) ; J8.4 41.28,28.42 v1(39.53,28.42) ; R34.1 22.54,43.18 v1(22.54,41.28)
  Bottom Layer w0.254: v1(39.53,28.42) 33.3,34.65 v1(33.3,35.56) ; v1(24.92,35.72) 24.92,37.31 22.54,39.69 v1(22.54,41.28)
R_RTN: length 29.2
  Top Layer w0.254: J8.3 41.28,27.05 37.34,27.05 34.8,24.51 25.27,24.51 24.13,25.65 24.13,28.7 22.48,30.35 22.48,35.31 R30.2
R_SENSE: length 113.2
  Top Layer w0.254: v1(10.72,34.14) 10.52,34.34 7.57,34.34 7.62,34.29 7.62,33.15 IC5.2 ; v1(34.54,36.19) 34.16,36.58 20.32,36.58 19.94,36.19 v1(17.02,36.19) ; v1(52.71,27.31) 53.09,27.31 53.34,27.05 56.51,27.05 60.32,30.86 60.32,32.49 61.39,33.55 64.74,33.55 v1(65.66,32.64) ; v1(69.6,35.94) 69.98,35.94 70.23,36.19 79.38,36.19 81.46,38.28 81.46,48.21 v1(80.39,49.28)
  Bottom Layer w0.254: v1(69.6,35.94) 69.6,36.07 69.34,36.32 66.93,36.32 65.79,35.18 65.79,32.77 v1(65.66,32.64) ; v1(17.02,36.19) 16.26,36.19 14.2,34.14 v1(10.72,34.14) ; v1(52.71,27.31) 45.85,34.16 36.58,34.16 v1(34.54,36.19) ; R.TP 72.75,57.66 76.96,53.44 ANALOG_A8-A15.4 77.09,52.58 v1(80.39,49.28)
REGEN: length 14.5
  Top Layer w0.254: U1.6 71.44,18.26 71.44,14.13 64.29,6.99 DIGITAL_22-53.34
REVERSE: length 11.7
  Top Layer w0.254: U1.5 70.8,18.26 70.8,16.03 64.29,9.53 DIGITAL_22-53.32
RX1_DBW: length 11.1
  Top Layer w0.254: v1(74.68,10.92) 74.68,11.28 76.53,13.13 77.15,13.13
  Bottom Layer w0.254: v1(74.68,10.92) 74.73,10.88 74.73,7.31 76.96,5.08 DIGITAL_16-21.3
SOLENOID_OUT: length 10
  Top Layer w0.813: J3.4 8.43,14.64 PB1_BRAKE_ON.3
SOLENOID_POWER: length 27
  Bottom Layer w0.813: PB1_BRAKE_ON.5 20.59,6.6 25.91,6.6 28.45,9.15 PB2_12/24.3
SPEEDOMETER: length 32.7
  Top Layer w0.254: U1.8 72.71,18.26 v1(72.71,17.14) ; DIGITAL_22-53.13 61.72,31.33 60.58,30.19 60.58,29.92 55.63,24.97 55.63,22.78 56.01,22.4 59.59,22.4 v1(59.77,22.22)
  Bottom Layer w0.254: v1(59.77,22.22) 61.09,20.9 64.66,20.9 65.25,20.32 69.53,20.32 v1(72.71,17.14)
STEER_ON: length 8.3
  Bottom Layer w0.254: DIGITAL_22-53.28 64.26,14.61 63.12,15.75 61.21,15.75 59.44,17.53 57.4,17.53 R2.1
STEER_PULSE: length 9.2
  Top Layer w0.254: U1.4 70.17,18.26 70.17,17.46 64.77,12.06 64.29,12.06 DIGITAL_22-53.30
THROTTLE: length 26
  Bottom Layer w0.254: 55.83,45.24 55.88,45.34 56.51,45.97 56.51,46.1 57.4,46.99 57.4,49.4 56.97,49.83 56.97,50.44 57.73,51.21 58.45,51.21 60.12,49.53 71.75,49.53 74.42,52.2 ANALOG_A8-A15.5
TX1_DBW: length 10.8
  Top Layer w0.254: DIGITAL_16-21.4 78.56,5.26 78.56,8.66 79.78,9.88 79.81,9.88 79.81,11.3 79.23,11.88 77.15,11.88
WATCHDOG: length 6.2
  Top Layer w0.254: U1.3 69.53,18.42 69.53,19.05 v1(69.06,19.53)
  Bottom Layer w0.254: DIGITAL_22-53.24 64.29,19.53 v1(69.06,19.53)

## Copper pours and planes (outline as drawn; the poured copper is in the pictures)
GND on Top Layer: 0,0 0,60 86.11,60 86.11,0
GND on Bottom Layer: 0,0 0,60 86.11,60 86.11,0

## Text on the board
Top Silkscreen Layer: 52 | 50 | 48 | 46 | 44 | 42 | 40 | 38 | 36 | 34 | 32 | 30 | 28 | 26 | 24 | 22 | Gnd | 53 | 51 | 49 | 47 | 45 | 43 | 41 | 39 | 37 | 35 | 33 | 29 | 27 | 25 | 23 | 31 | SCL (21) | SDA (20) | RX1 (19) | TX1 (18) | RX2 (17) | TX2 (16) | + | S | A15 | A14 | DAC1 | DAC0 | A11 | A10 | A9 | A8 | 5v | - | DBW e-bike v4.1
